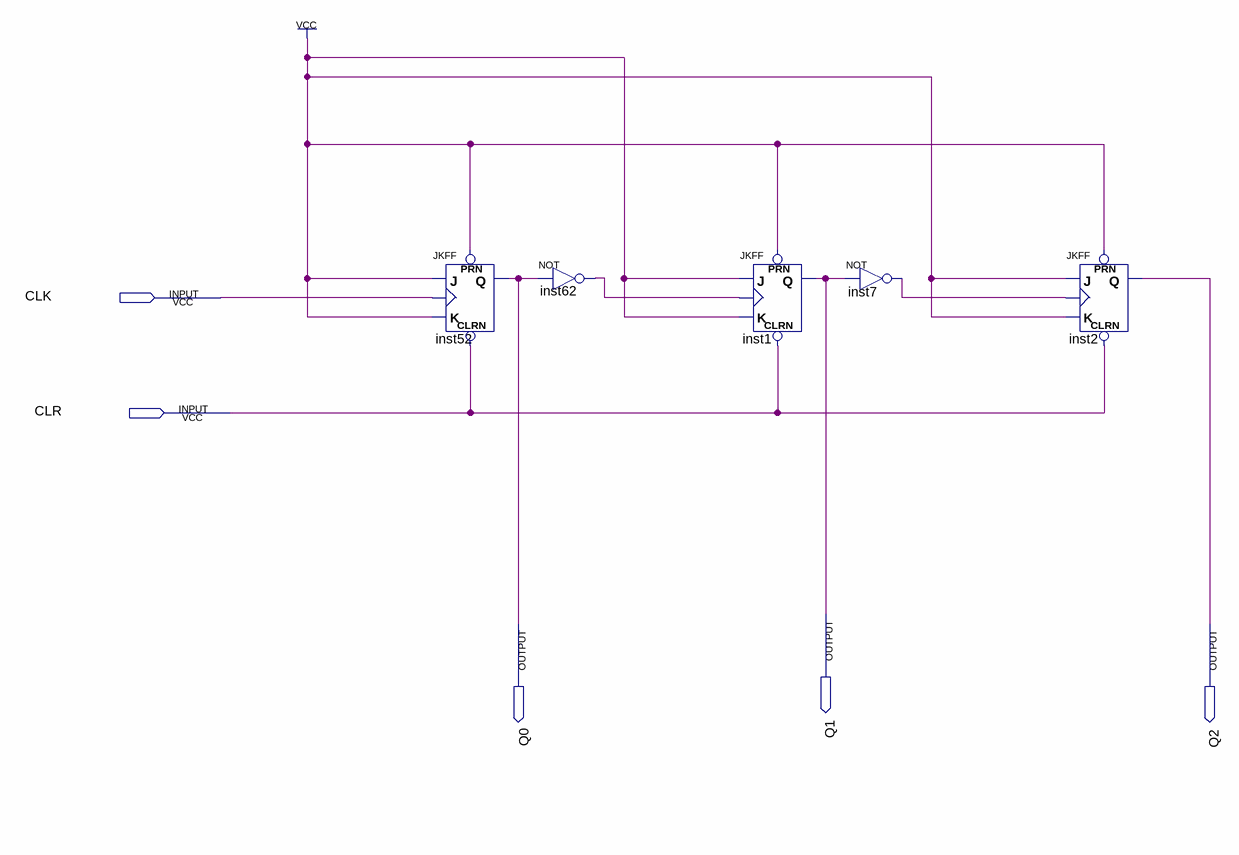
[diagram p0: schematic sheet]
// Quartus schematic ModOcho.bdf as structural Verilog: 5 symbols, 5 pins
module ModOcho (
  input  CLK,
  input  CLR,
  output Q1,
  output Q0,
  output Q2
);

  wire inst7_out, inst62_out;

  JKFF inst52 (.PRN(1'b1), .CLRN(CLR), .K(1'b1), .J(1'b1), .CLK(CLK), .Q(Q0));
  not inst62 (inst62_out, Q0);
  JKFF inst1 (.PRN(1'b1), .CLRN(CLR), .K(1'b1), .J(1'b1), .CLK(inst62_out), .Q(Q1));
  not inst7 (inst7_out, Q1);
  JKFF inst2 (.PRN(1'b1), .CLRN(CLR), .K(1'b1), .J(1'b1), .CLK(inst7_out), .Q(Q2));
endmodule
